# EAGLE design MQ9_pcb (EAGLE 9.5.2)
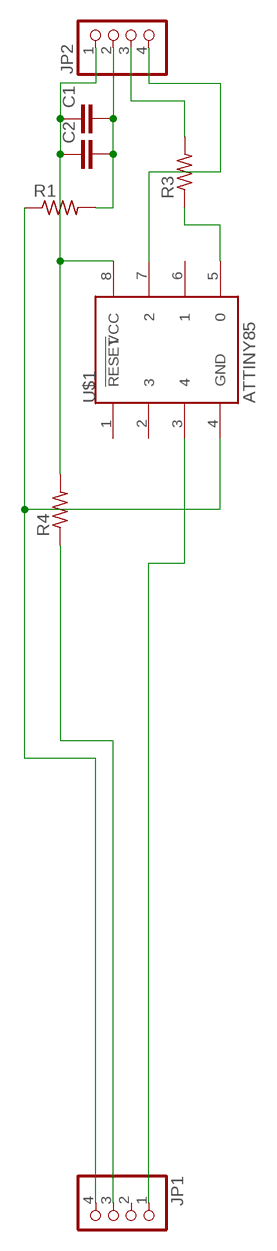
[diagram p0: schematic, sheet 1]

## Parts
C1  C2,5-3  [C2.5-3]
C2  C5/2.5  [C5B2.5]
JP1  PINHD-1X4  [1X04]
JP2  PINHD-1X4/90  [1X04/90]
R1  R-US_0204/5  [0204/5]
R3  R-US_0204/5  [0204/5]
R4  R-US_0204/5  [0204/5]
U$1  ATTINY85  [8P3]

## Nets
N$1: C1.2 C2.2 JP2.2 R1.2
N$2: C1.1 C2.1 JP2.1 R4.2 U$1.8(VCC)
N$4: JP1.4 R1.1 U$1.4(GND)
N$7: R3.1 U$1.5
N$8: JP2.3 R3.2
N$9: JP2.4 U$1.7
N$10: JP1.1 U$1.3
N$11: JP1.3 R4.1
Unconnected: JP1.2 U$1.1(!RESET) U$1.2 U$1.6

## Library data of the parts
C1 C2 = capacitor-wima:C: CAPACITOR naming: grid - package width
JP1 JP2 = pinhead:PINHD-1X4: PIN HEADER
R1 R3 R4 = rcl:R-US_: RESISTOR, American symbol; SPICEPREFIX: R
U$1 = attiny85:ATTINY85

## Board
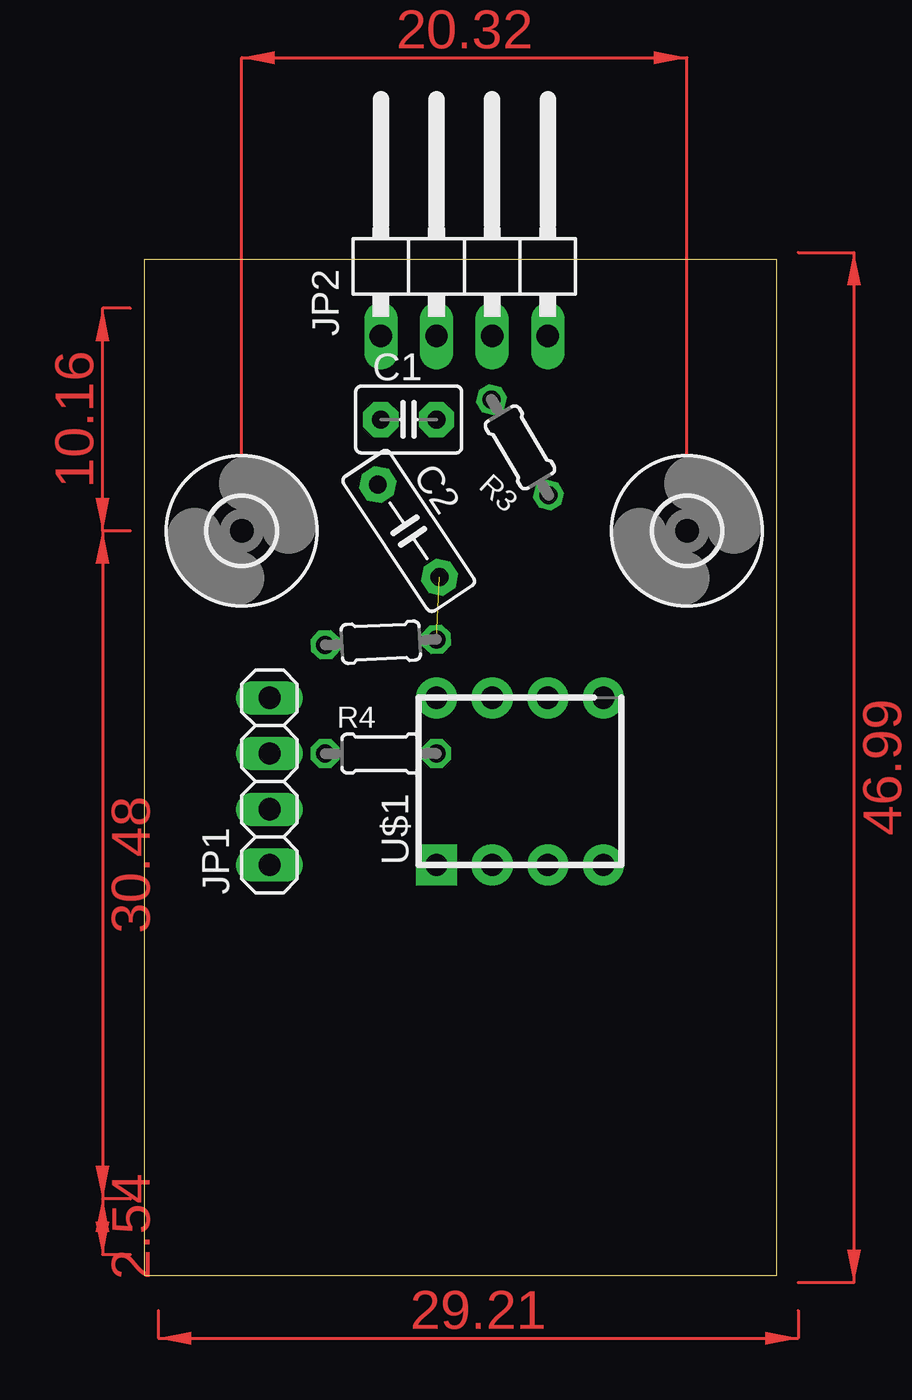
[diagram p1: board, top side]
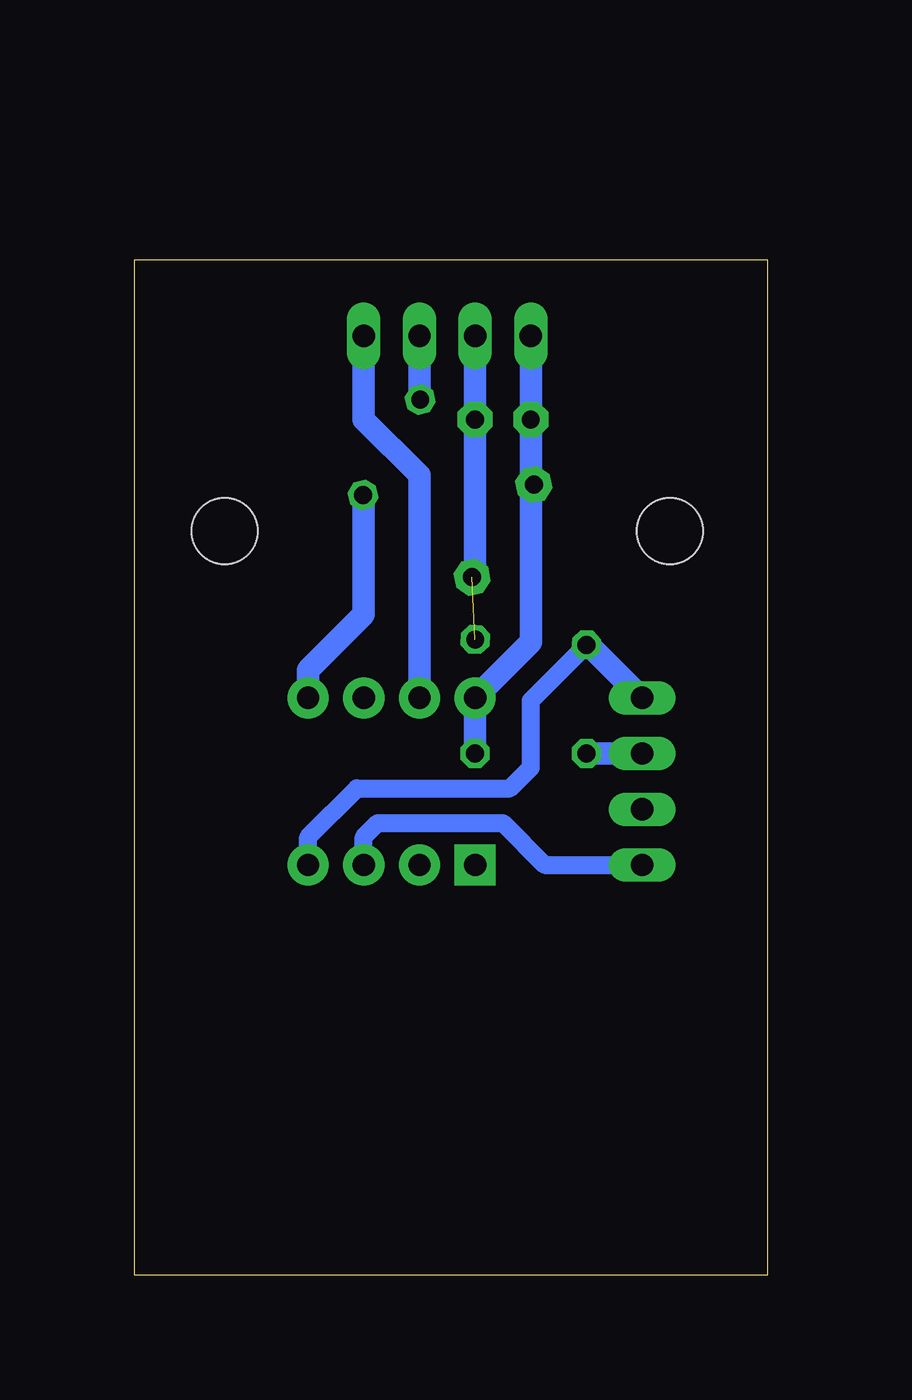
[diagram p2: board, bottom side, seen from below]

Size 28.87 x 46.34 mm. Coordinates in mm from the lower left corner, seen from the top.
Outline: 0,0 28.87,0 28.87,46.34 0,46.34 0,0
Copper layers (1*16): Top 0.035mm / dielectric 1.5mm / Bottom 0.035mm
Design rules "default": minimum track width 6mil, minimum drill 0.35mm, track to track 6mil, track to pad 6mil, pad to pad 6mil, via to via 6mil, smd to smd 6mil, copper to edge 40mil, drill to drill 6mil, minimum pad ring 10mil, minimum via ring 8mil, stop-mask expansion 4mil, vias tented up to drill 0mil, thermal gap 10mil

### Footprints (pad centres in the part's own frame; a part is rotated, then mirrored left to right if it is on the bottom)
C2.5-3 = drill 0.813 pad 1.6 octagon: 1 -1.27,0; 2 1.27,0
C5B2.5 = drill 0.813 pad 1.6 octagon: 1 -2.54,0; 2 2.54,0
1X04 = drill 1.016 long: 1 -3.81,0; 2 -1.27,0; 3 1.27,0; 4 3.81,0
1X04/90 = drill 1.016 long: 1 -3.81,-3.81; 2 -1.27,-3.81; 3 1.27,-3.81; 4 3.81,-3.81
0204/5 = drill 0.813 octagon: 1 -2.54,0; 2 2.54,0
8P3 = drill 1.016 pad 1.88 square: 1 -3.81,3.81 | drill 1.016 pad 1.88: 2 -3.81,1.27; 3 -3.81,-1.27; 4 -3.81,-3.81; 5 3.81,-3.81; 6 3.81,-1.27; 7 3.81,1.27; 8 3.81,3.81
3,0 = hole 3: 0,0

### Placement (x,y rotation side)
C1  12.06,39.05 0 top
C2  12.06,33.97 303.7 top
JP1  5.72,22.54 90 top
JP2  14.6,46.67 0 top
R1  10.79,28.89 2.8 top
R3  17.15,37.78 120.9 top
R4  10.79,23.81 0 top
U$1  17.15,22.54 90 top
U$2  [3,0]  4.45,33.97 0 top
U$3  [3,0]  24.77,33.97 0 top

### Tracks (layer width: path | path; a pad name or v marks a point on that pad's centre or on a via)
N$1  (1 unrouted)
  Bottom 1.016: JP2.2 C1.2 13.33,31.88 C2.2
N$2
  Bottom 1.016: JP2.1 C1.1 10.79,36.22 C2.1 10.79,35.95 10.79,28.89 U$1.8 R4.2
N$4
  Bottom 0.813: U$1.4 20.95,20 18.73,22.22 11.75,22.22 10.79,23.18 10.79,26.23 R1.1
  Bottom 1.016: JP1.4 8.13,28.77 R1.1
N$7
  Bottom 1.016: U$1.5 20.95,27.62 18.41,30.16 18.41,35.57 R3.1
N$8
  Bottom 1.016: JP2.3 15.88,39.95 R3.2
N$9
  Bottom 1.016: JP2.4 18.41,39.05 15.88,36.51 U$1.7
N$10
  Bottom 0.813: U$1.3 18.41,20 17.78,20.64 12.06,20.64 10.16,18.73 JP1.1
N$11
  Bottom 1.016: R4.1 JP1.3
(copper drawn outside any net)
  shapes: Top area x7